# EAGLE design ndice (EAGLE 9.1.0)
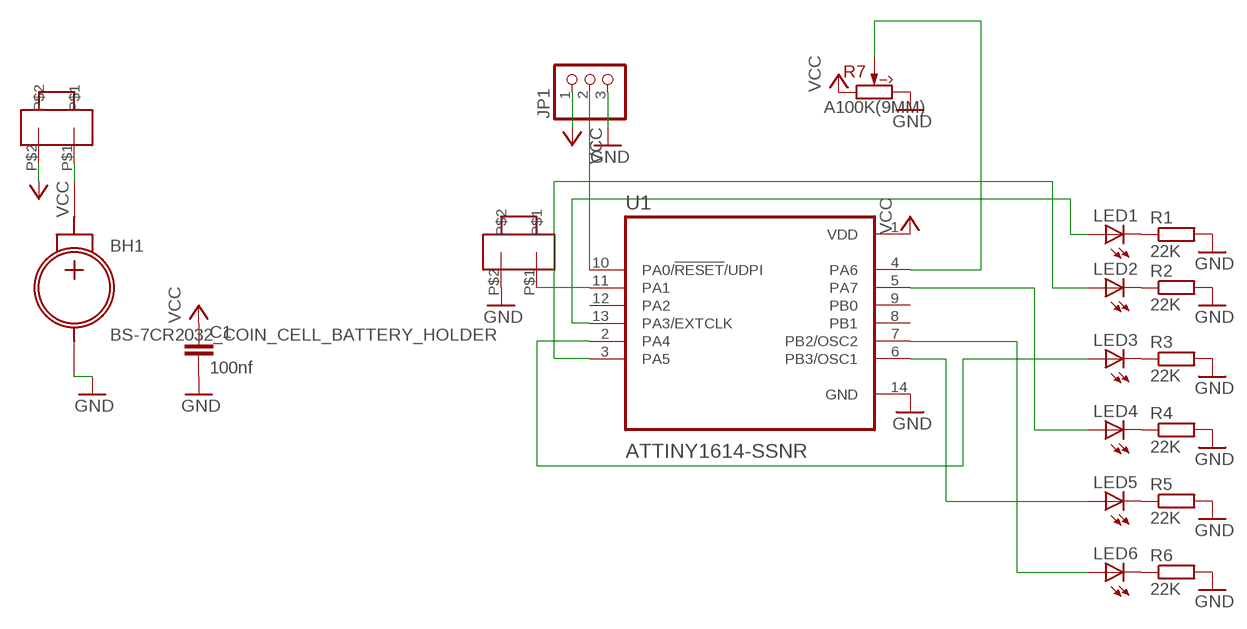
[diagram p0: schematic, sheet 1]

## Parts
BH1  BS-7CR2032_COIN_CELL_BATTERY_HOLDER  [BS-7]
C1  100nf  C-EUC0805  [C0805]
JP1  PINHD-1X3CB  [1X03-CLEANBIG]
LED1  LEDSML0805  [SML0805]
LED2  LEDSML0805  [SML0805]
LED3  LEDSML0805  [SML0805]
LED4  LEDSML0805  [SML0805]
LED5  LEDSML0805  [SML0805]
LED6  LEDSML0805  [SML0805]
R1  22K  R-EU_R0805  [R0805]
R2  22K  R-EU_R0805  [R0805]
R3  22K  R-EU_R0805  [R0805]
R4  22K  R-EU_R0805  [R0805]
R5  22K  R-EU_R0805  [R0805]
R6  22K  R-EU_R0805  [R0805]
R7  A100K(9MM)  [RV09-SINGLE]
U1  ATTINY1614-SSNR  [SOIC127P600X175-14N]
U$1  SIDEBUTTON  [SMD]
U$2  SIDEBUTTON  [SMD]

## Nets
GND: BH1.NEG C1.2 JP1.3 R1.2 R2.2 R3.2 R4.2 R5.2 R6.2 R7.3(CW) U1.14(GND) U$2.P$2
N$1: BH1.POS U$1.P$1
N$2: U1.11(PA1) U$2.P$1
N$3: JP1.2 U1.10(PA0/!RESET!/UDPI)
N$6: LED1.C R1.1
N$7: LED2.C R2.1
N$8: LED3.C R3.1
N$9: LED4.C R4.1
N$10: LED5.C R5.1
N$11: LED6.C R6.1
N$12: LED1.A U1.13(PA3/EXTCLK)
N$13: LED2.A U1.3(PA5)
N$14: LED3.A U1.2(PA4)
N$15: LED4.A U1.5(PA7)
N$16: LED5.A U1.6(PB3/OSC1)
N$17: LED6.A U1.7(PB2/OSC2)
N$18: R7.2(W) U1.4(PA6)
VCC: C1.1 JP1.1 R7.1(CCW) U1.1(VDD) U$1.P$2
Unconnected: U1.8(PB1) U1.9(PB0) U1.12(PA2)

## Library data of the parts
BH1 = CR2032_coin_cell_battery_holder:BS-7; AVAILABILITY: Unavailable; DESCRIPTION: CR2032 holder, battery rel; MF: MPD; MP: BS-7; PACKAGE: None; PRICE: None
C1 = rcl:C-EU: CAPACITOR, European symbol; SPICEPREFIX: C
JP1 = adafruit:PINHD-1X3: PIN HEADER
LED1-LED6 = led:LED: LED OSRAM: - CHIPLED LG R971, LG N971, LY N971, LG Q971, LY Q971, LO R971, LY R971 LH N974, LH R974 LS Q976, LO Q976, LY Q976 LO Q996 - Hyper CHIPLED LW Q18S LB Q993, LB Q99A, LB R99A - SideLED LS A670, LO A670, LY A670, LG A670, LP A670 LB A673, LV A673, LT A673, LW A673 LH A674 LY A675 LS A676, LA A676, LO A676, LY A676, LW A676 LS A679, LY A679, LG A679 - Hyper Micro SIDELED® LS Y876, LA Y876, LO Y876, LY Y876 LT Y87S - SmartLED LW L88C, LW L88S LB L89C, LB L89S, LG L890 LS L89K, LO L89K, LY L89K LS L896, LA L896, LO L896, LY L896 - TOPLED LS T670, LO T670, LY T670, LG T670, LP T670 LSG T670, LSP T670, LSY T670, LOP T670, LYG T670 LG T671, LOG T671, LSG T671 LB T673, LV T673, LT T673, LW T673 LH T674 LS T676, LA T676, LO T676, LY T676, LB T676, LH T676, LSB T676, LW T676 LB T67C, LV T67C, LT T67C, LS T67K, LO T67K, LY T67K, LW E67C LS E67B, LA E67B, LO E67B, LY E67B, LB E67C, LV E67C, LT E67C LW T67C LS T679, LY T679, LG T679 LS T770, LO T770, LY T770, LG T770, LP T770 LB T773, LV T773, LT T773, LW T773 LH T774 LS E675, LA E675, LY E675, LS T675 LS T776, LA T776, LO T776, LY T776, LB T776 LHGB T686 LT T68C, LB T68C - Hyper Mini TOPLED® LB M676 - Mini TOPLED Santana® LG M470 LS M47K, LO M47K, LY M47K Source: http://www.osram.convergy.de LUXEON: - LUMILED® LXK2-PW12-R00, LXK2-PW12-S00, LXK2-PW14-U00, LXK2-PW14-V00 LXK2-PM12-R00, LXK2-PM12-S00, LXK2-PM14-U00 LXK2-PE12-Q00, LXK2-PE12-R00, LXK2-PE12-S00, LXK2-PE14-T00, LXK2-PE14-U00 LXK2-PB12-K00, LXK2-PB12-L00, LXK2-PB12-M00, LXK2-PB14-N00, LXK2-PB14-P00, LXK2-PB14-Q00 LXK2-PR12-L00, LXK2-PR12-M00, LXK2-PR14-Q00, LXK2-PR14-R00 LXK2-PD12-Q00, LXK2-PD12-R00, LXK2-PD12-S00 LXK2-PH12-R00, LXK2-PH12-S00 LXK2-PL12-P00, LXK2-PL12-Q00, LXK2-PL12-R00 Source: www.luxeon.com KINGBRIGHT: KA-3528ASYC Source: www.kingbright.com
R1-R6 = rcl:R-EU_: RESISTOR, European symbol; SPICEPREFIX: R
R7 = potentiometers:?; MOUSER: 688-RK09D113AF25A15
U1 = ATTINY1614-SSNR:ATTINY1614-SSNR: 20MHz, SOIC, 85C, Green, 14 SOIC .150in T/R; AVAILABILITY: Unavailable; DESCRIPTION: 20MHz, SOIC, 85C, Green, 14 SOIC .150in T/R; MF: Microchip; MP: ATTINY1614-SSNR; PACKAGE: SO-14 Microchip; PRICE: None
U$1 U$2 = sidebutton:SIDEBUTTON

## Board
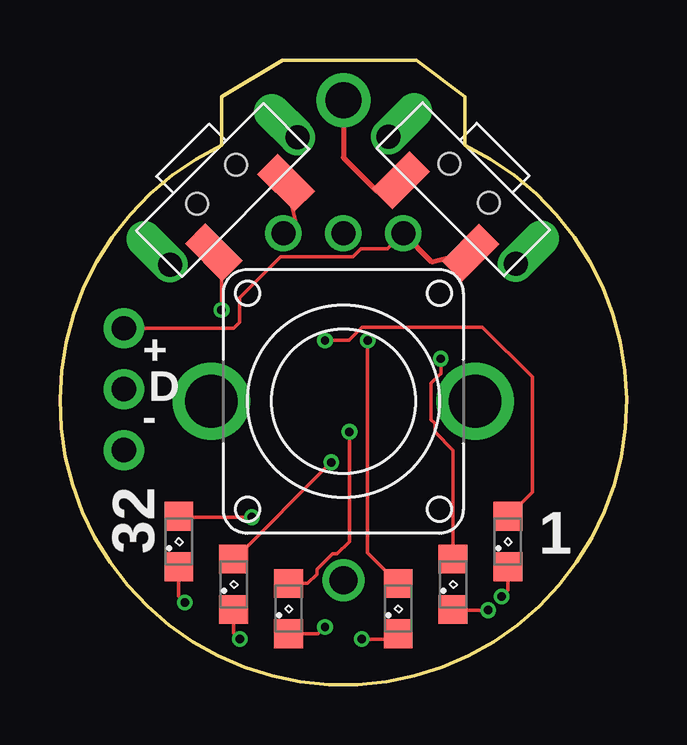
[diagram p1: board, top side]
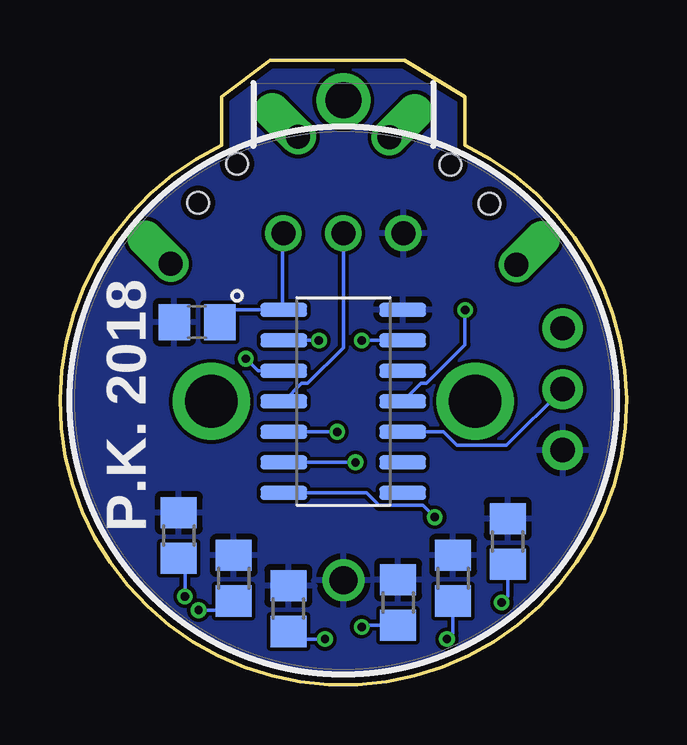
[diagram p2: board, bottom side, seen from below]

Size 23.63 x 26.02 mm. Coordinates in mm from the lower left corner, seen from the top.
Outline: 16.9,22.47 16.9,24.5 14.86,26.02 9.28,26.02 6.74,24.5 6.74,22.47 arc309 16.9,22.47
Copper layers (1*16): Top 0.035mm / dielectric 1.5mm / Bottom 0.035mm
Design rules "SeeedStudio_2layer_DRU_no_angle_20140221": minimum track width 6mil, minimum drill 12mil, track to track 6mil, track to pad 6mil, pad to pad 6mil, via to via 6mil, smd to smd 0mil, copper to edge 10mil, drill to drill 10mil, minimum pad ring 10mil, minimum via ring 6mil, stop-mask expansion 2mil, vias tented up to drill 100mil, thermal gap 10mil

### Footprints (pad centres in the part's own frame; a part is rotated, then mirrored left to right if it is on the bottom)
BS-7 = drill 1.17: NEG -10,0 | drill 1.5: POS 10,0
C0805 = smd 1.3 x 1.5: 1 -0.95,0; 2 0.95,0
1X03-CLEANBIG = drill 1.016 pad 1.676: 1 -2.54,0; 2 0,0; 3 2.54,0
SML0805 = smd 1.2 x 1.2: A 1.05,0; C -1.05,0
R0805 = smd 1.3 x 1.5: 1 -0.95,0; 2 0.95,0
RV09-SINGLE = drill 1: 1 -2.5,-7; 2 0,-7; 3 2.5,-7 | drill 2.2: S1 -5.5,0; S2 5.5,0
SOIC127P600X175-14N = smd 1.95 x 0.59: 1 -2.48,3.81; 2 -2.48,2.54; 3 -2.48,1.27; 4 -2.48,0; 5 -2.48,-1.27; 6 -2.48,-2.54; 7 -2.48,-3.81; 8 2.48,-3.81; 9 2.48,-2.54; 10 2.48,-1.27; 11 2.48,0; 12 2.48,1.27; 13 2.48,2.54; 14 2.48,3.81
SMD = smd 2.2 x 1.2: P$1 2.923,1.65; P$2 3.002,5.837 | drill 1 offset: SHIELD$1 2,0; SHIELD$2 2,7.5 | hole 0.9: 1,2.6; 1,4.9

### Placement (x,y rotation side)
BH1  11.82,14.34 90 bottom
C1  17.91,15.1 180 bottom
JP1  2.67,12.31 270 top
LED1  18.67,5.96 90 top
LED2  16.39,4.18 90 top
LED3  14.1,3.16 90 top
LED4  9.53,3.16 90 top
LED5  7.24,4.18 90 top
LED6  4.96,5.96 90 top
R1  18.67,6.21 90 bottom
R2  16.39,4.43 90 bottom
R3  14.1,3.16 90 bottom
R4  9.53,3.42 90 bottom
R5  7.24,4.43 90 bottom
R6  4.96,5.96 90 bottom
R7  11.82,11.8 180 top
U1  11.82,11.8 0 bottom
U$1  15.12,24.25 225 top
U$2  3.18,18.91 315 top

### Tracks (layer width: path | path; a pad name or v marks a point on that pad's centre or on a via)
GND
  Top 0.152: U$2.P$2 9.83,19.31 R7.3
  pour Bottom: -0.88,27.04 24.52,27.04 24.52,-0.9 -0.88,-0.9
N$1
  Top 0.203: BH1.POS 11.82,21.96 13.21,20.57 U$1.P$1
N$2  (via drill 0.35)
  Top 0.152: v6.74,15.61 6.74,17.45 U$2.P$1
  Bottom 0.152: U1.11 8.59,12.55 8.35,12.55 6.74,14.16 v6.74,15.61
N$3
  Bottom 0.152: U1.10 7.64,10.53 7.08,9.96 5.02,9.96 JP1.2
N$6  (via drill 0.35)
  Top 0.152: LED1.C 18.67,3.93 v18.42,3.67
  Bottom 0.152: v18.42,3.67 18.42,5.01 R1.1
N$7  (via drill 0.35)
  Top 0.152: v17.85,3.1 16.42,3.1 LED2.C
  Bottom 0.152: R2.1 16.77,3.1 v17.85,3.1
N$8  (via drill 0.35)
  Top 0.152: LED3.C 13.88,1.89 v12.58,1.89
  Bottom 0.152: v12.58,1.89 13.78,1.89 R3.1
N$9  (via drill 0.35)
  Top 0.152: v11.05,2.4 10.77,2.11 LED4.C
  Bottom 0.152: R4.1 10.99,2.47 v11.05,2.4
N$10  (via drill 0.35)
  Top 0.152: LED5.C 7.24,2.15 v7.5,1.89
  Bottom 0.152: v7.5,1.89 7.24,2.15 R5.1
N$11  (via drill 0.35)
  Top 0.152: v5.21,3.42 4.96,3.67 LED6.C
  Bottom 0.152: R6.1 4.96,3.67 v5.21,3.42
N$12  (via drill 0.35)
  Top 0.152: v11.05,14.34 12.05,14.34 12.6,14.9 17.61,14.9 19.69,12.82 19.69,8.02 LED1.A
  Bottom 0.152: U1.13 v11.05,14.34
N$13  (via drill 0.35)
  Top 0.152: v15.88,13.58 15.88,12.96 15.81,12.89 | 15.81,12.89 15.48,12.56 | 15.81,12.89 15.48,12.56 | 15.48,12.56 15.48,11.04 15.63,10.89 15.63,10.53 16.39,9.77 LED2.A
  Bottom 0.152: U1.3 15.37,13.07 v15.88,13.58
N$14  (via drill 0.35)
  Top 0.152: v12.83,14.34 12.83,5.48 LED3.A
  Bottom 0.152: U1.2 v12.83,14.34
N$15  (via drill 0.35)
  Top 0.152: v12.07,10.53 12.07,5.96 11.56,5.45 11.36,5.45 10.71,4.8 10.71,4.6 10.33,4.21 LED4.A
  Bottom 0.152: U1.5 v12.07,10.53
N$16  (via drill 0.35)
  Top 0.152: v11.31,9.26 7.28,5.23 LED5.A
  Bottom 0.152: U1.6 v11.31,9.26
N$17  (via drill 0.35)
  Top 0.152: v8.01,6.97 4.99,6.97 LED6.A
  Bottom 0.152: v8.01,6.97 8.5,7.47 10.32,7.47 10.84,7.99 U1.7
N$18
  Bottom 0.152: U1.4 13.55,12.55 13.31,12.55 11.82,14.04 R7.2
VCC
  Top 0.152: R7.1 13.67,18.15 12.56,18.15 12.22,17.82 10.55,17.82 9.2,17.82 7.5,16.12 7.5,15.1 7.24,14.85 JP1.1
  Top 0.203: U$1.P$2 15.52,17.6 R7.1
  Bottom 0.152: C1.1 16.45,15.61 14.36,15.61 | 14.36,15.61 U1.1 | R7.1 14.36,18.76 14.36,15.61

### Text on the board
tPlace: + | D | - | 32 | 1
bPlace: P.K. 2018